# Altium project Brakelight_New.PrjPcb
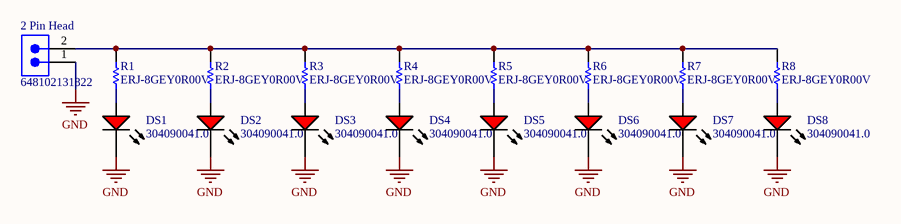
[diagram p0: BrakeLight_Schematic.SchDoc]
1 sheet, 17 parts. Net scope: global (net labels, ports and power ports of the same name join across sheets).
Board file: PCB_Design.PcbDoc

## Sheet BrakeLight_Schematic.SchDoc
size A; SheetNumber: 1; SheetTotal: 1

### Parts
2_Pin_Head  648102131822  [648102131822]
DS1  304090041.0  [LED-2P-2.28-3MM_A]
DS2  304090041.0  [LED-2P-2.28-3MM_A]
DS3  304090041.0  [LED-2P-2.28-3MM_A]
DS4  304090041.0  [LED-2P-2.28-3MM_A]
DS5  304090041.0  [LED-2P-2.28-3MM_A]
DS6  304090041.0  [LED-2P-2.28-3MM_A]
DS7  304090041.0  [LED-2P-2.28-3MM_A]
DS8  304090041.0  [LED-2P-2.28-3MM_A]
R1  ERJ-8GEY0R00V  [RESC3216X70X50NL05T20]
R2  ERJ-8GEY0R00V  [RESC3216X70X50NL05T20]
R3  ERJ-8GEY0R00V  [RESC3216X70X50NL05T20]
R4  ERJ-8GEY0R00V  [RESC3216X70X50NL05T20]
R5  ERJ-8GEY0R00V  [RESC3216X70X50NL05T20]
R6  ERJ-8GEY0R00V  [RESC3216X70X50NL05T20]
R7  ERJ-8GEY0R00V  [RESC3216X70X50NL05T20]
R8  ERJ-8GEY0R00V  [RESC3216X70X50NL05T20]

### Nets
GND: 2_Pin_Head.1 DS1.2(K) DS2.2(K) DS3.2(K) DS4.2(K) DS5.2(K) DS6.2(K) DS7.2(K) DS8.2(K)
Net2_Pin_Head_2: 2_Pin_Head.2 R1.2 R2.2 R3.2 R4.2 R5.2 R6.2 R7.2 R8.2
NetDS1_1: DS1.1(A) R1.1
NetDS2_1: DS2.1(A) R2.1
NetDS3_1: DS3.1(A) R3.1
NetDS4_1: DS4.1(A) R4.1
NetDS5_1: DS5.1(A) R5.1
NetDS6_1: DS6.1(A) R6.1
NetDS7_1: DS7.1(A) R7.1
NetDS8_1: DS8.1(A) R8.1

### Library data of the parts
2_Pin_Head = CMP-1502-00730-2: NexarPartId: 18818251; Voltage Rating: 50V; Number of Positions: 2; Insulation: Insulated; Current Rating: 1A; Contact Resistance: 20mΩ; Connector Type: Male Pin; Pitch: 1.5mm; Insulation Resistance: 500MΩ; Gender: Male; Number of Pins: 2; Operating Supply Voltage: 50V; Max Operating Temperature: 85°C; REACH SVHC: Unknown; Termination: SMD/SMT; Number of Contacts: 2; Min Operating Temperature: -25°C; Length: 6mm; Color: Beige, White; Housing Material: Nylon; Contact Material: Copper; Number of Rows: 1; RoHS: Compliant; Flammability Rating: UL94 V-0; Width: 6mm; Contact Gender: Male; Mount: Surface Mount; Lead Pitch: 1.5mm; Height: 3.7mm; Contact Plating: Tin; Packaging: Tape and Reel
DS1-DS8 = CMP-2100-03574-1: Red LED, 1.9 to 2.4 V, -25 to 85 degC, 2-Pin THD; Manufacturer: Shenzhen CGX; Manufacturer URL: http://szcgx.com/; Package Description: 2-Pin Through Hole Device, Dia 3 mm, Pitch 2.28 mm; Datasheet URL: http://datasheet.octopart.com/304090041-Chengguangxing-datasheet-62330656.pdf; Package Reference: 304090041.0; Datasheet Version: 41883.0
R1-R8 = CMP-2003-00541-1: Manufacturer: Panasonic; Part Number: ERJ-8GEY0R00V